# EAGLE design LEDMatrix_V1.0 (EAGLE 9.4.1)
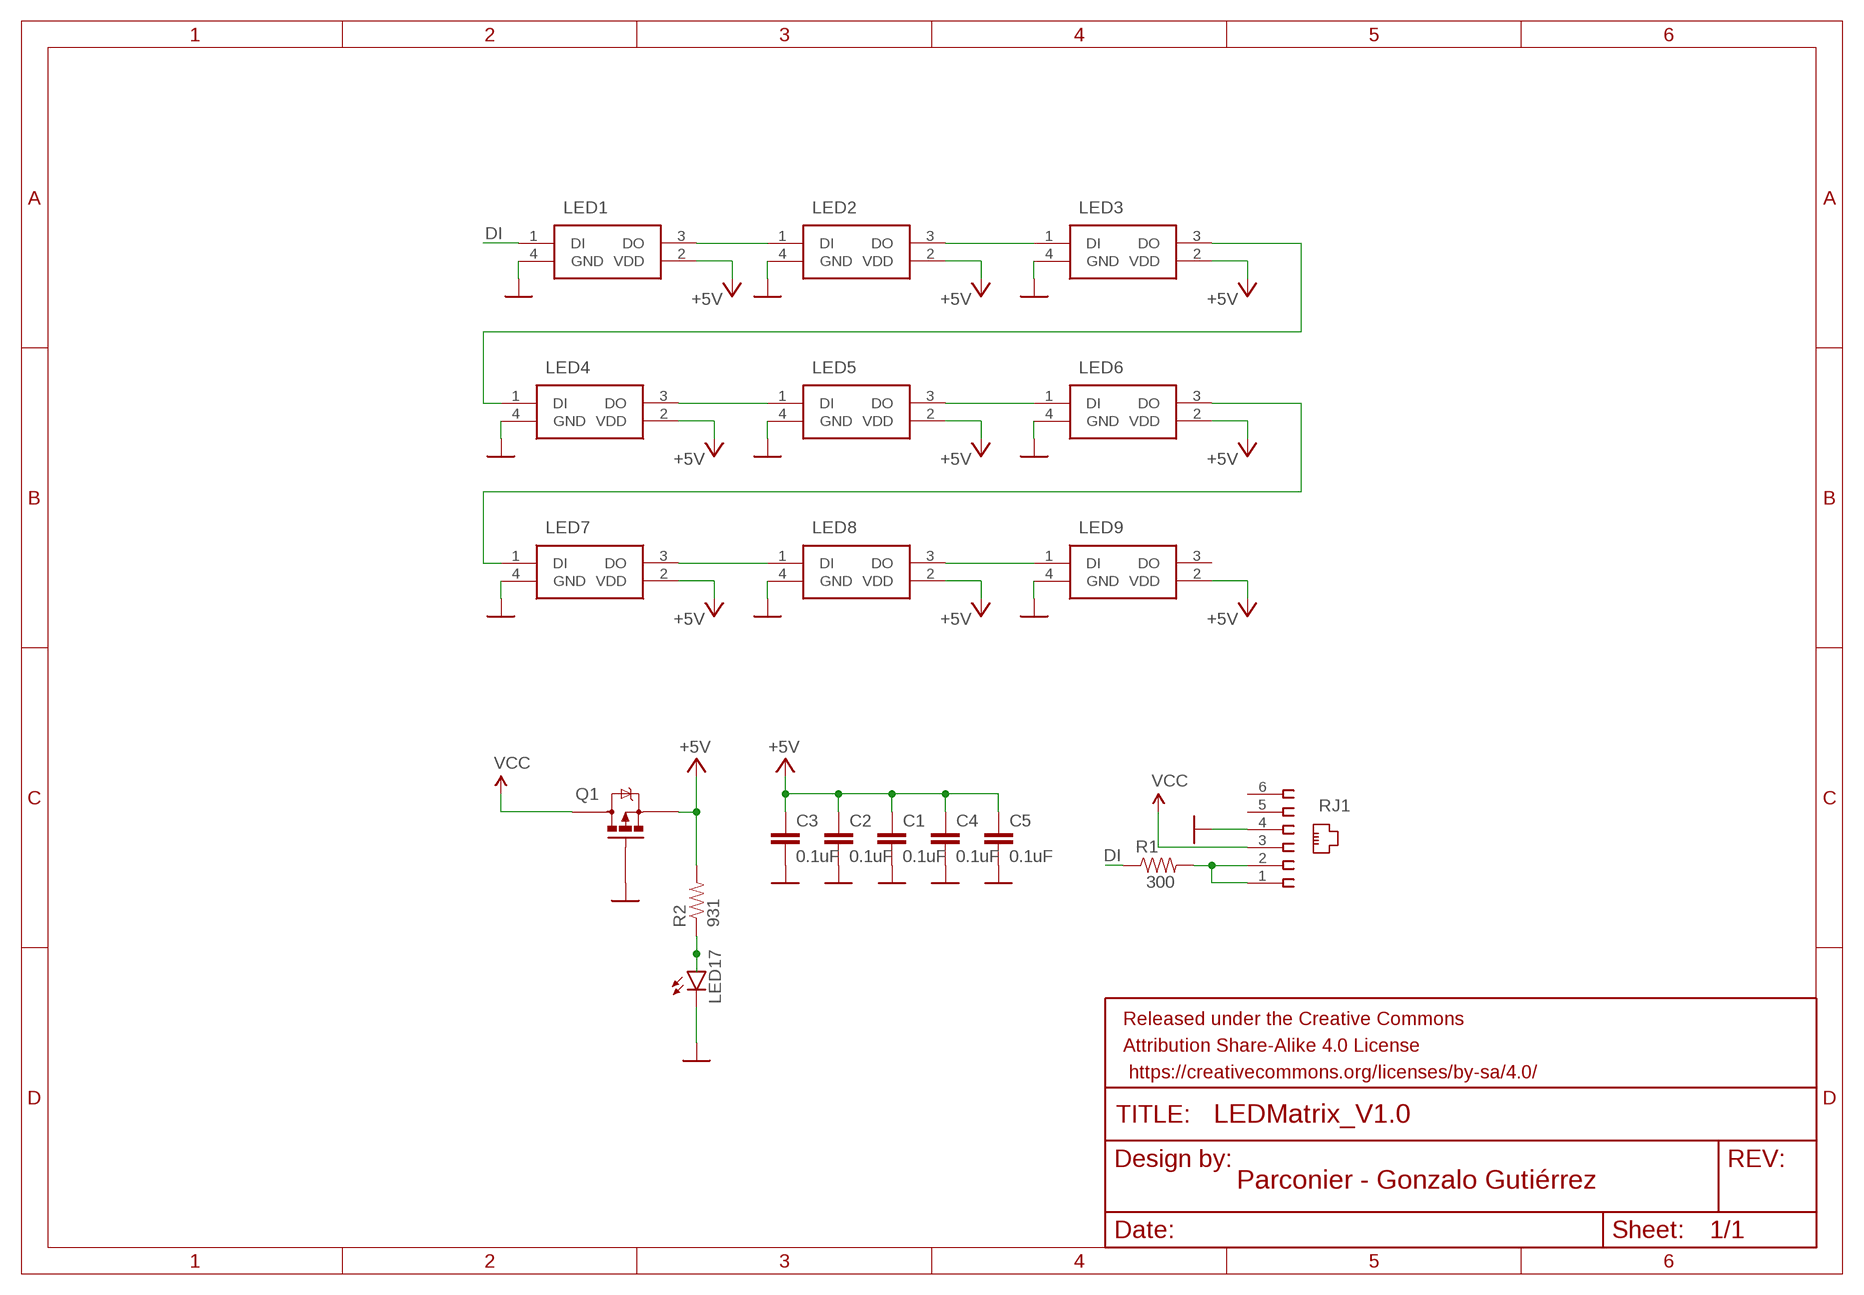
[diagram p0: schematic, sheet 1]

## Parts
C1  0.1uF  CAP_0402  [0402]
C2  0.1uF  CAP_0402  [0402]
C3  0.1uF  CAP_0402  [0402]
C4  0.1uF  CAP_0402  [0402]
C5  0.1uF  CAP_0402  [0402]
LED1  SK6812MINI  [SK6812MINI]
LED2  SK6812MINI  [SK6812MINI]
LED3  SK6812MINI  [SK6812MINI]
LED4  SK6812MINI  [SK6812MINI]
LED5  SK6812MINI  [SK6812MINI]
LED6  SK6812MINI  [SK6812MINI]
LED7  SK6812MINI  [SK6812MINI]
LED8  SK6812MINI  [SK6812MINI]
LED9  SK6812MINI  [SK6812MINI]
LED17  LED0603  [LED-0603]
Q1  IRLML2244TRPBF  [SOT95P237X112-3N]
R1  300  RES_0402  [RESC1005X35]
R2  931  RES_0402  [RESC1005X35]
RJ1  615006138421  [615006138421]

## Nets
+5V: C1.1 C2.1 C3.1 C4.1 C5.1 LED1.2(VDD) LED2.2(VDD) LED3.2(VDD) LED4.2(VDD) LED5.2(VDD) LED6.2(VDD) LED7.2(VDD) LED8.2(VDD) LED9.2(VDD) Q1.2(S) R2.2
DI: LED1.1(DI) R1.1
GND: C1.2 C2.2 C3.2 C4.2 C5.2 LED1.4(GND) LED2.4(GND) LED3.4(GND) LED4.4(GND) LED5.4(GND) LED6.4(GND) LED7.4(GND) LED8.4(GND) LED9.4(GND) LED17.C Q1.1(G) RJ1.4
N$1: LED1.3(DO) LED2.1(DI)
N$2: LED2.3(DO) LED3.1(DI)
N$3: LED3.3(DO) LED4.1(DI)
N$4: LED5.3(DO) LED6.1(DI)
N$5: LED17.A R2.1
N$7: LED4.3(DO) LED5.1(DI)
N$8: LED6.3(DO) LED7.1(DI)
N$9: LED7.3(DO) LED8.1(DI)
N$10: LED8.3(DO) LED9.1(DI)
N$18: R1.2 RJ1.1 RJ1.2
VCC: Q1.3(D) RJ1.3
Unconnected: LED9.3(DO) RJ1.5 RJ1.6

## Library data of the parts
C1-C5 = Perfect_0402:CAP_0402: 0402 (1005 Metric) Nick Garner - TeleSense; MPN: CC0402KRX5R9BB104
LED1-LED9 = COM-11821:SK6812MINI; MPN: SK6812MINI; SPICEPREFIX: E
LED17 = SparkFun-LED:LED: LEDs Standard schematic elements and footprints for 5mm, 3mm, 1206, and 0603 sized LEDs. 5mm - Spark Fun Electronics SKU : COM-00529 (and others); MPN: LTST-C193KRKT-5A
Q1 = IRLML2244TRPBF:IRLML2244TRPBF: HEXFET Power MOSFET Source: Datasheet; ARROW_PART_NUMBER: IRLML2244TRPBF; DESCRIPTION: HEXFET Power MOSFET; HEIGHT: mm; MANUFACTURER_NAME: International Rectifier; MANUFACTURER_PART_NUMBER: IRLML2244TRPBF; MPN: IRLML2244TRPBF
R1 = Perfect_0402:RES_0402; MPN: RC0402JR-07300RL
R2 = Perfect_0402:RES_0402; MPN: RC0402FR-07931RL
RJ1 = 615006138421:615006138421: HORIZONTAL PLASTIC 6P6C MODULAR JACK TAP UP Source: Datasheet <http://docs-europe.electrocomponents.com/webdocs/0f88/0900766b80f88670.pdf>; DESCRIPTION: HORIZONTAL PLASTIC 6P6C MODULAR JACK TAP UP; HEIGHT: mm; MANUFACTURER_NAME: W&uuml;rth Elektronik; MANUFACTURER_PART_NUMBER: 615006138421; MPN: 615006138421; RS_PART_NUMBER: 7350282; SUPPLIER_NAME: RS

## Board
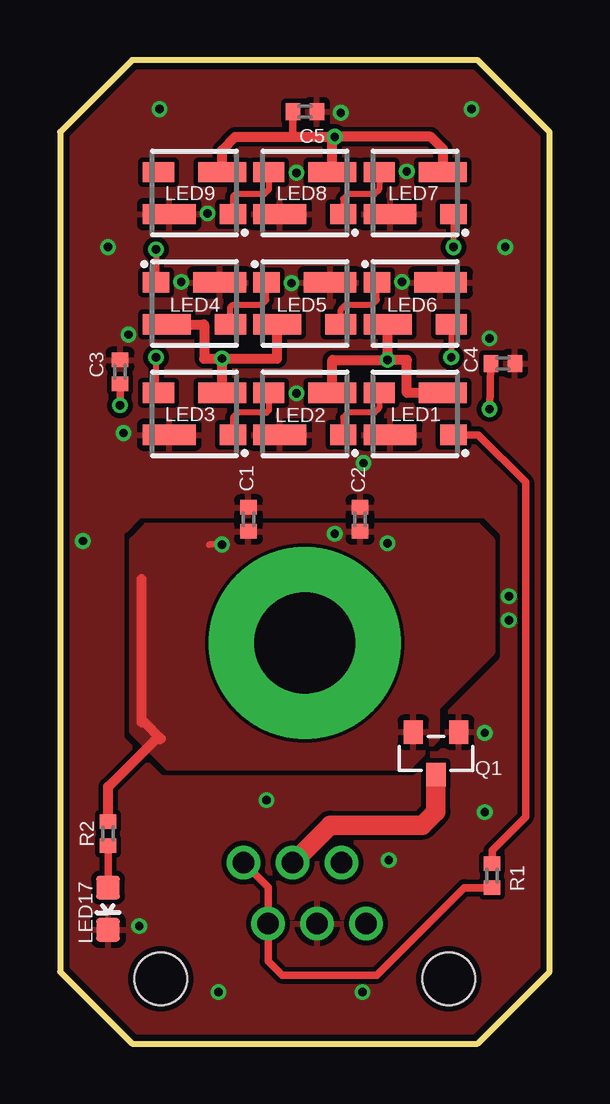
[diagram p1: board, top side]
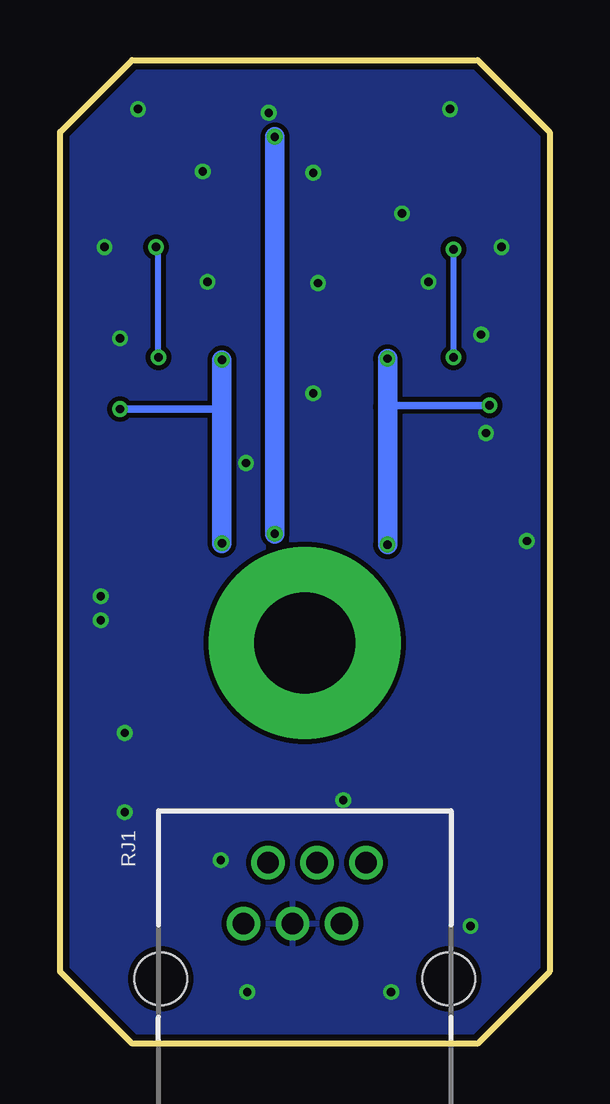
[diagram p2: board, bottom side, seen from below]

Size 20.4 x 41 mm. Coordinates in mm from the lower left corner, seen from the top.
Outline: 0,38 0,3 3,0 17.4,0 20.4,3 20.4,38 17.4,41 3,41 0,38
Copper layers (1*16): Top 0.035mm / dielectric 1.5mm / Bottom 0.035mm
Design rules "SeeedStudio_2layer_DRU_no_angle_20140221": minimum track width 6mil, minimum drill 12mil, track to track 6mil, track to pad 6mil, pad to pad 6mil, via to via 6mil, smd to smd 0mil, copper to edge 10mil, drill to drill 10mil, minimum pad ring 10mil, minimum via ring 6mil, stop-mask expansion 2mil, vias tented up to drill 100mil, thermal gap 10mil

### Footprints (pad centres in the part's own frame; a part is rotated, then mirrored left to right if it is on the bottom)
0402 = smd 0.6 x 0.7: 1 -0.5,0; 2 0.5,0
SK6812MINI = smd 1.1 x 0.85: 1 1.6,-0.875 | smd 2 x 0.85: 2 1.15,0.875 | smd 1.3 x 0.85: 3 -1.5,0.875 | smd 2.2 x 0.85: 4 -1.05,-0.875
LED-0603 = smd 1 x 1: A 0,-0.877; C 0,0.877
SOT95P237X112-3N = smd 0.972 x 0.802: 1 -0.885,0.95; 2 -0.885,-0.95; 3 0.885,0
RESC1005X35 = smd 0.6 x 0.7: 1 -0.5,0; 2 0.5,0
615006138421 = drill 0.9 pad 1.4: 1 2.55,4.84; 2 1.53,2.3; 3 0.51,4.84; 4 -0.51,2.3; 5 -1.53,4.84; 6 -2.55,2.3 | hole 2.2: -6,0; 6,0

### Placement (x,y rotation side)
C1  7.85,21.85 90 top
C2  12.5,21.85 90 top
C3  2.5,28 90 top
C4  18.45,28.35 0 top
C5  10.2,38.85 0 top
LED1  14.8,26.25 0 top
LED2  10.2,26.25 0 top
LED3  5.6,26.25 0 top
LED4  5.6,30.85 180 top
LED5  10.2,30.85 180 top
LED6  14.8,30.85 180 top
LED7  14.8,35.45 0 top
LED8  10.2,35.45 0 top
LED9  5.6,35.45 0 top
LED17  2,5.62 180 top
Q1  15.66,12.1 270 top
R1  18,7 270 top
R2  2,8.75 90 top
RJ1  10.2,2.7 0 bottom

### Tracks (layer width: path | path; a pad name or v marks a point on that pad's centre or on a via)
+5V  (via drill 0.35)
  Top 0.254: v6.75,20.8 6.2,20.8
  Top 0.305: C5.1 9.7,37.85 9.65,37.8 | C3.1 v2.5,26.6 | C4.1 v17.9,26.45
  Top 0.406: R2.2 2,10.7 4,12.7 4.2,12.7 3.5,13.4 3.4,13.4 3.4,19.35 | LED3.2 v6.75,28.55 | LED4.2 6,29.98 6,28.55 v6.75,28.55 | v6.75,28.55 9.05,28.55 LED5.2 | LED2.2 11.35,28.5 v13.65,28.5 | v13.65,28.5 LED6.2 | LED1.2 14.45,27.12 14.45,28.5 v13.65,28.5 | LED9.2 6.75,37.25 7.3,37.8 9.65,37.8 v11.45,37.8 | v11.45,37.8 15.45,37.8 15.95,37.3 LED7.2 | LED8.2 11.35,37.7 v11.45,37.8
  Bottom 0.305: v2.5,26.6 6.7,26.6 6.75,26.55 | v17.9,26.45 13.65,26.45
  Bottom 0.813: v6.75,28.55 6.75,26.55 v6.75,20.8 | v13.65,28.5 13.65,26.45 v13.65,20.85 | v11.45,37.8 v11.45,21.25
  pour Top: 14.5,11.5 4.5,11.5 3,13 3,21 3.6,21.6 17.4,21.6 18,21 18,16.3 15.7,14 15.7,12.7
DI
  Top 0.305: LED1.1 17.43,25.38 19.4,23.4 19.4,9.45 18,8.05 R1.1
GND  (via drill 0.35)
  other vias: 8.6,10.15 6.6,2.15 12.6,2.15 0.95,20.95 4.15,38.95 18.7,18.65 18.7,17.65 13.7,7.65 17.7,9.65 17.7,12.95 2.65,25.45 9.85,27.1 12.65,24.2 17.9,29.4 2.85,29.55 14.25,31.75 9.65,31.7 5.05,31.75 14.45,36.35 9.85,36.3 6.15,34.6 11.7,38.8 17.15,38.95 18.55,33.2 2,33.2 3.3,4.9
  pour Bottom (isolate 0.2): 20.4,43.64 0,43.64 0,0 20.4,0
  pour Top (isolate 0.2, rank 2): 20.4,43.64 20.4,0 0,0 0,43.64
N$1
  Top 0.254: LED1.3 13.3,26.5 13.1,26.3 12,26.3 11.8,26.1 LED2.1
N$2
  Top 0.254: LED2.3 8.7,26.4 8.6,26.3 7.4,26.3 7.2,26.1 LED3.1
N$3  (via drill 0.35)
  Top 0.254: LED3.3 4,27.23 v4,28.6 | v4,33.1 LED4.1
  Bottom 0.254: v4,28.6 v4,33.1
N$4
  Top 0.254: LED5.3 11.7,30.6 11.9,30.8 13,30.8 13.2,31 LED6.1
N$5
  Top 0.305: LED17.A R2.1
N$6  (via drill 4.2 pad 8)
  other vias: 10.2,16.7
N$7
  Top 0.254: LED4.3 7.1,30.7 7.2,30.8 8.4,30.8 8.6,31 LED5.1
N$8  (via drill 0.35)
  Top 0.254: LED6.3 v16.3,28.6 | v16.4,33.2 LED7.1
  Bottom 0.254: v16.3,28.6 16.3,33.1 v16.4,33.2
N$9
  Top 0.254: LED7.3 13.3,35.6 13.1,35.4 12,35.4 11.8,35.2 LED8.1
N$10
  Top 0.254: LED8.3 8.7,35.6 8.5,35.4 7.3,35.4 7.2,35.3 LED9.1
N$18
  Top 0.305: R1.2 16.85,6.5 13.2,2.85 9.25,2.85 8.67,3.43 RJ1.2 8.67,6.52 RJ1.1
VCC
  Top 0.813: RJ1.3 11.25,9.1 15.1,9.1 15.66,9.66 Q1.3